# EAGLE schematic Esquema (EAGLE 9.6.2)
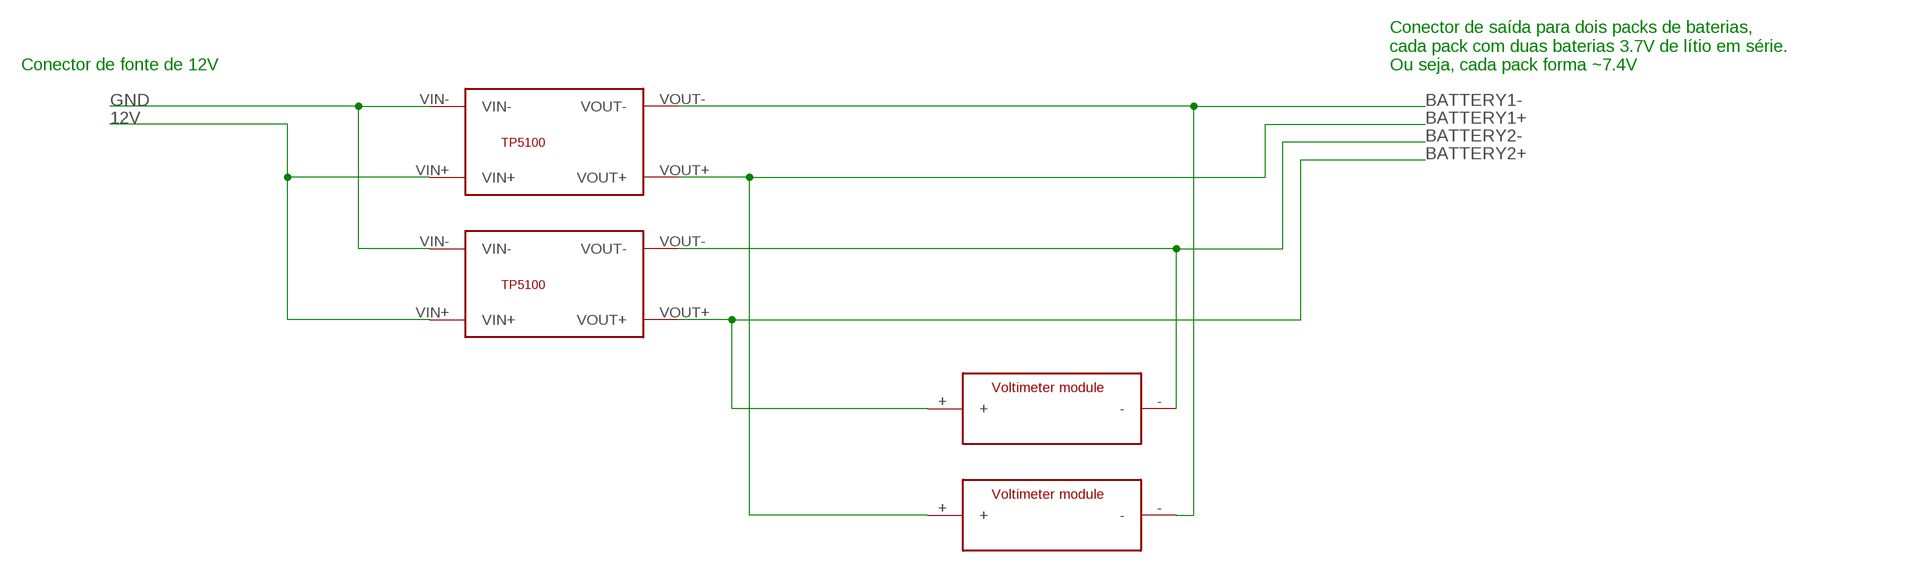
[diagram p0: schematic, sheet 1]

## Parts
U$1  TP5100  [TP5100_FOOTPRINT]
U$2  TP5100  [TP5100_FOOTPRINT]
U$3  VOLTIMETER_MODULE  [VOLTIMETER_MODULE_FOOTPRINT]
U$4  VOLTIMETER_MODULE  [VOLTIMETER_MODULE_FOOTPRINT]

## Nets
12V: U$1.VIN+ U$2.VIN+
BATTERY1+: U$1.VOUT+ U$4.+
BATTERY1-: U$1.VOUT- U$4.-
BATTERY2+: U$2.VOUT+ U$3.+
BATTERY2-: U$2.VOUT- U$3.-
GND: U$1.VIN- U$2.VIN-

## Notes on the sheet
- Conector de fonte de 12V
- Conector de saída para dois packs de baterias, 
  cada pack com duas baterias 3.7V de lítio em série.
  Ou seja, cada pack forma ~7.4V

## Library data of the parts
U$1 U$2 = CRD:TP5100
U$3 U$4 = CRD:VOLTIMETER_MODULE